# EasyEDA schematic schematics.json

## Sheets
1 Thal: TITLE: Thal; REV: C; Date: 2024-07-05; Sheet: 1/1; Drawn By: Arthur LAURENT; Company: Mental Noise
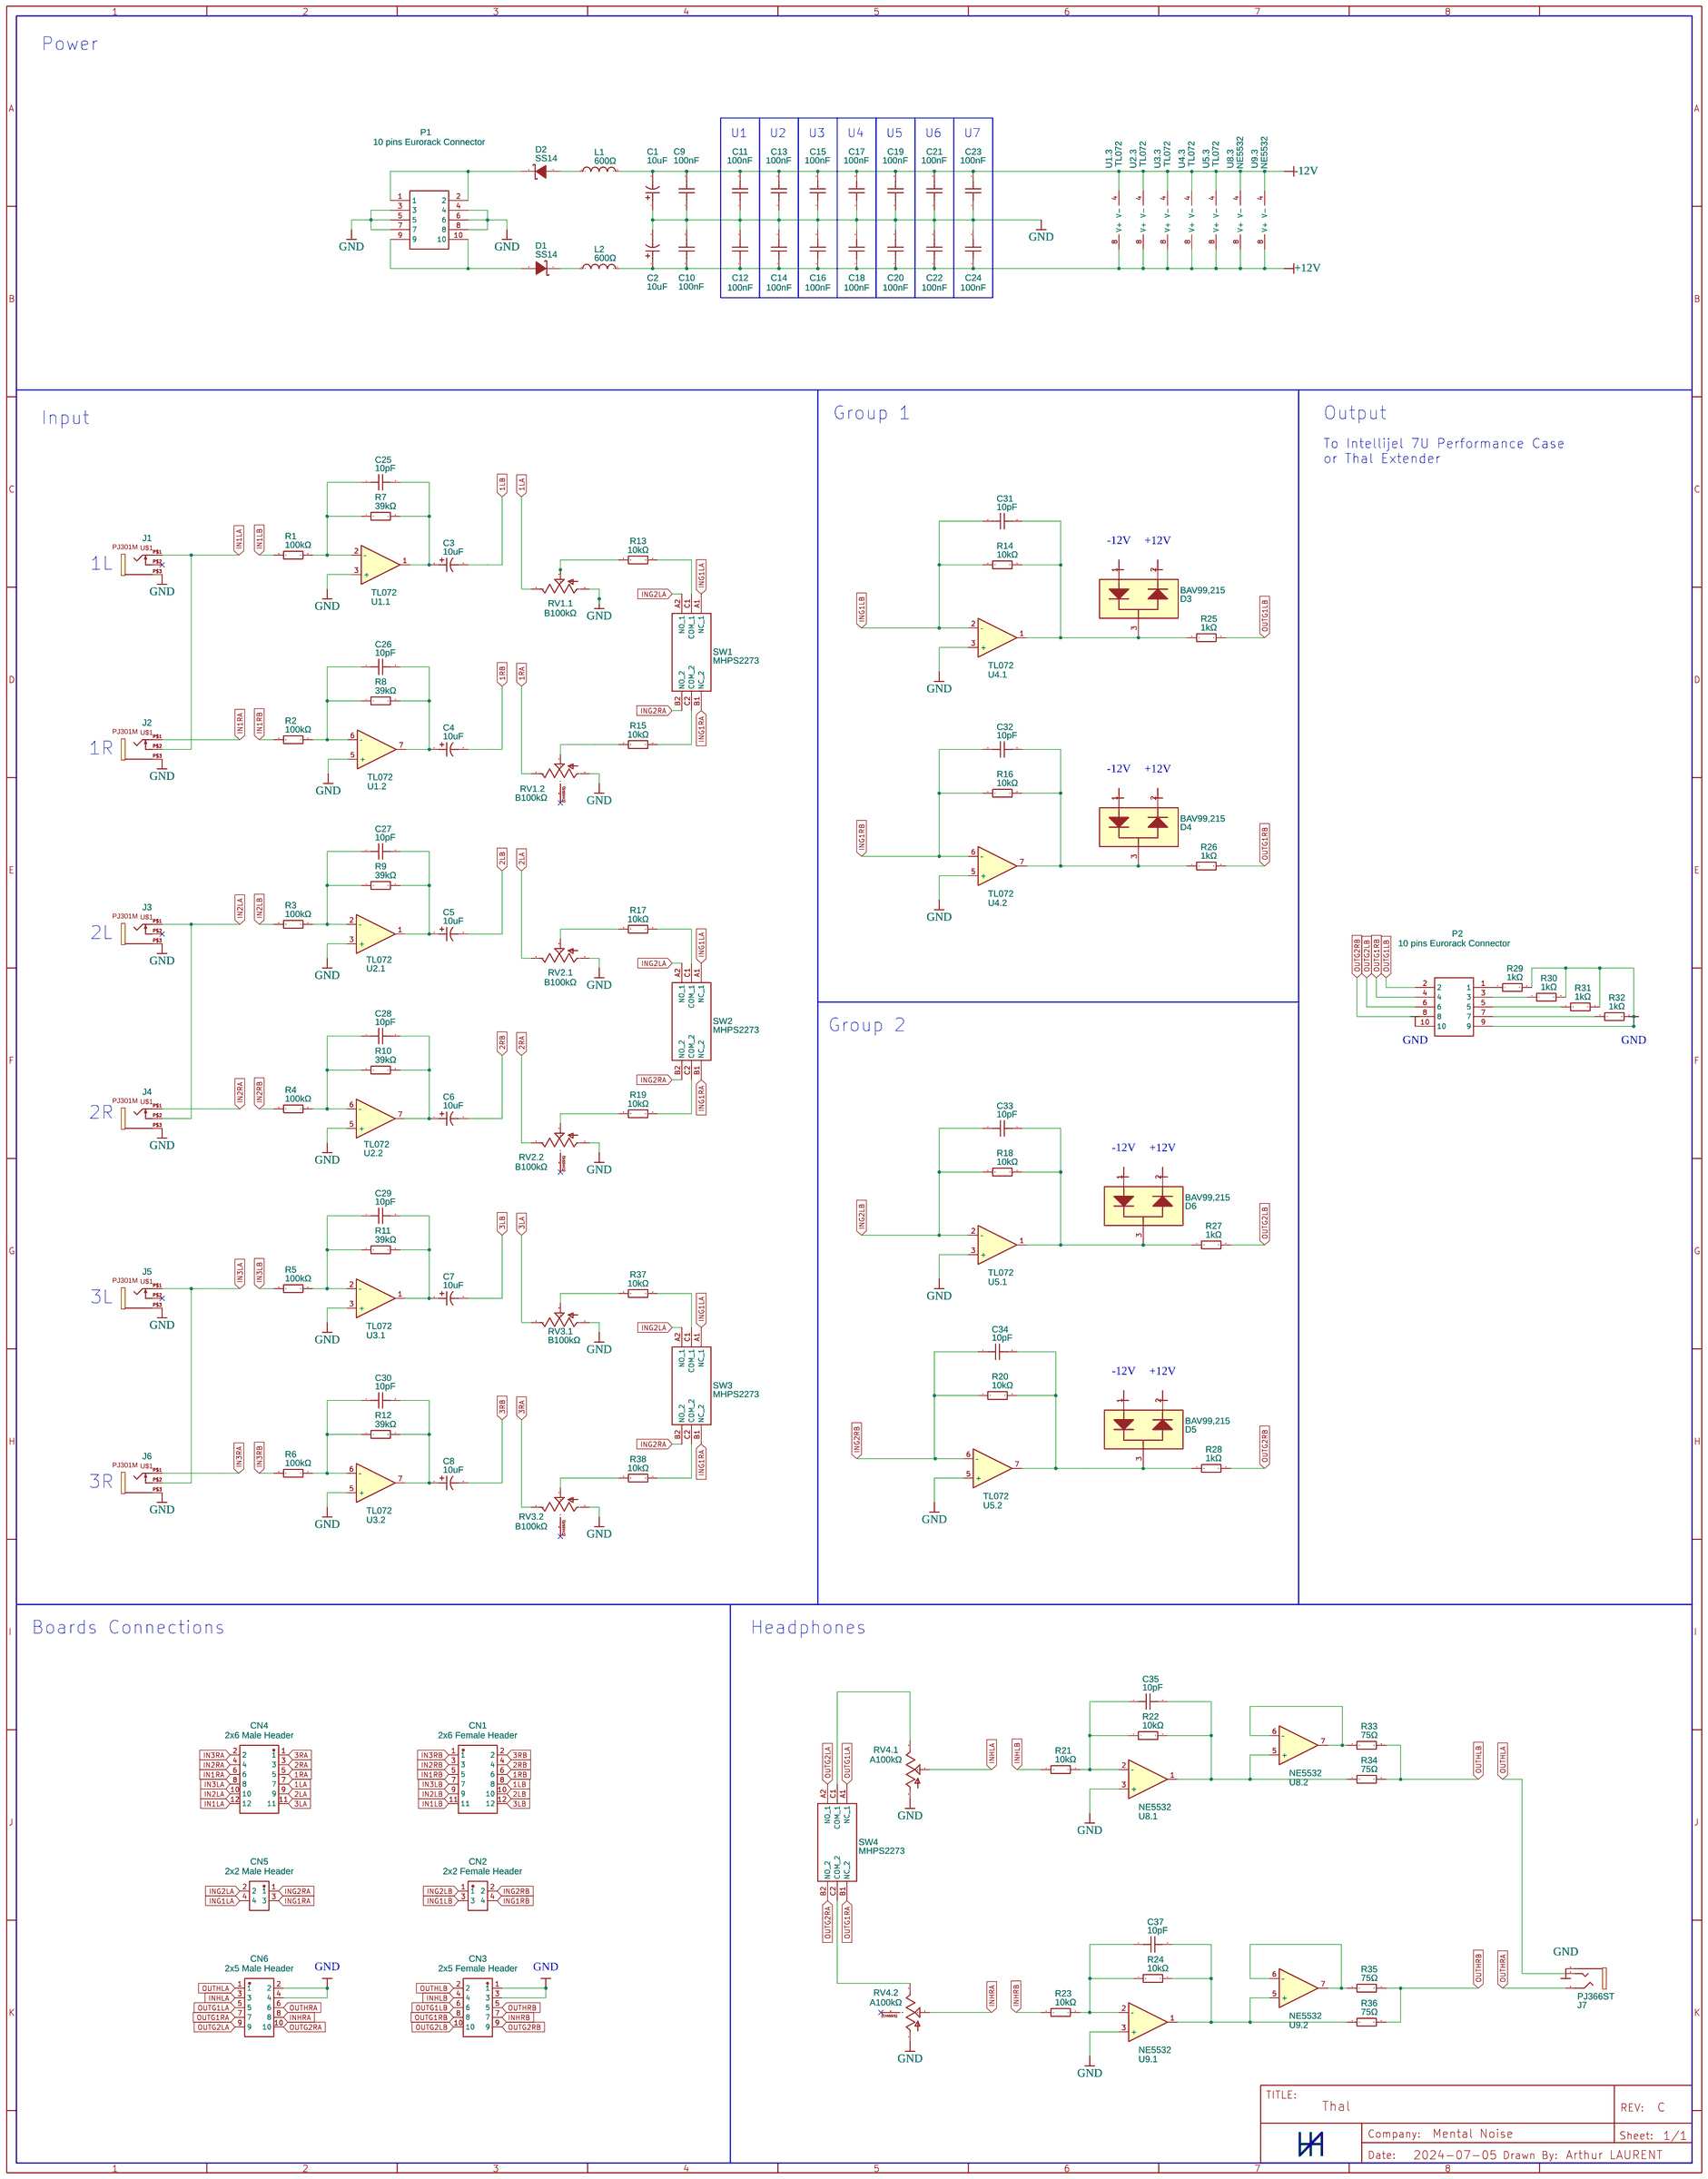
[diagram p0: Thal]
2 Extender: TITLE: Thal Extender; REV: A
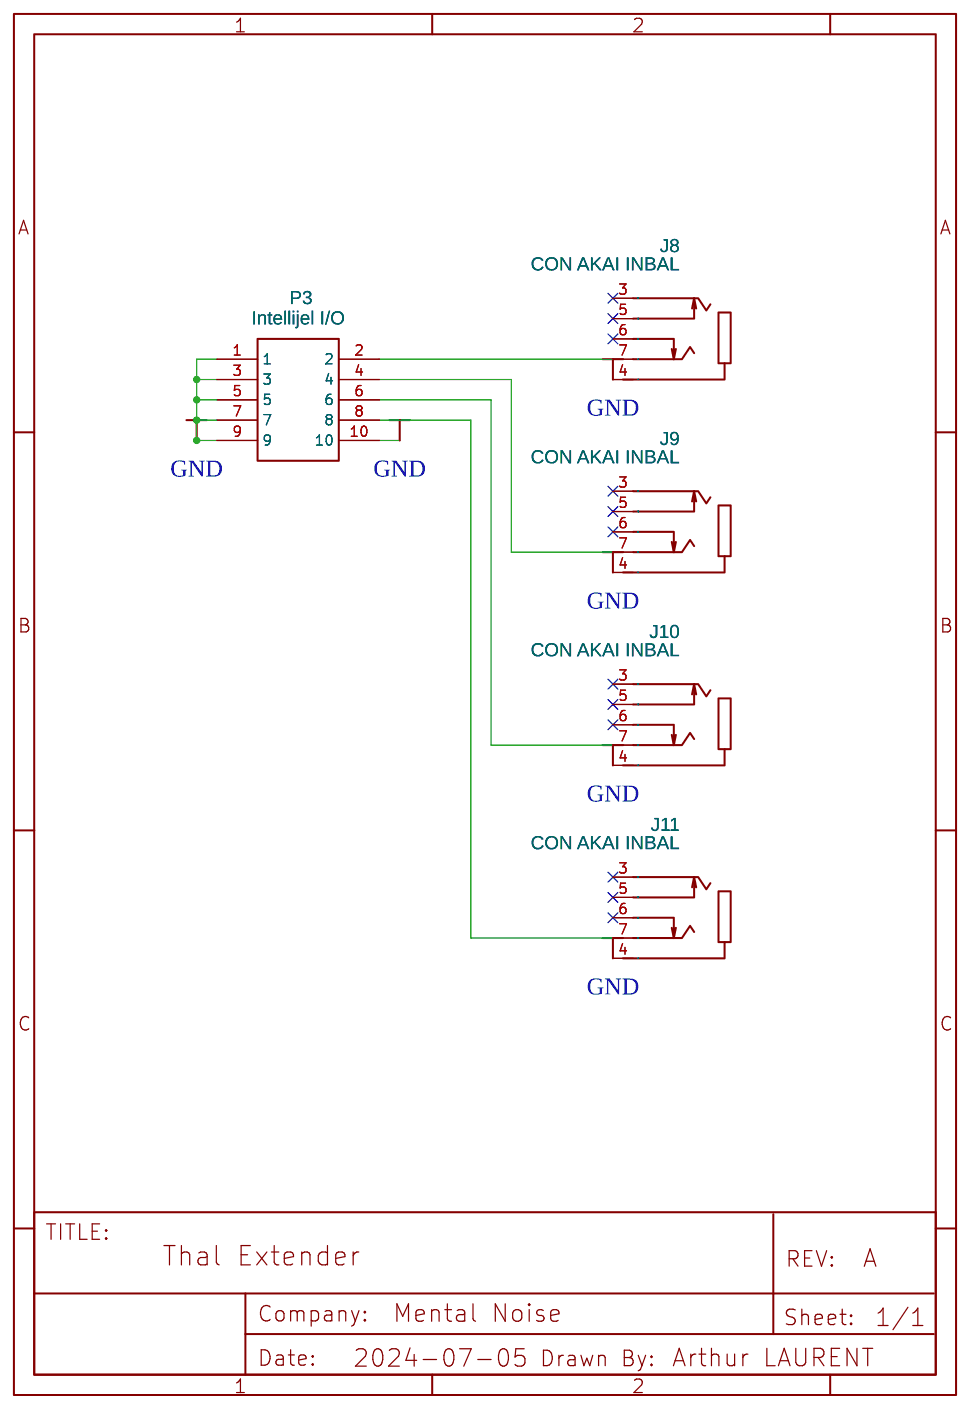
[diagram p1: Extender]

## Parts
sheet Extender
J8  CON AKAI INBAL  [PJ-612]
J9  CON AKAI INBAL  [PJ-612]
J10  CON AKAI INBAL  [PJ-612]
J11  CON AKAI INBAL  [PJ-612]
P3  Intellijel I/O  [IDC-TH_10P-P2.54-V-R2-C5-S2.54]
sheet Thal
C1  10uF  [CAP-TH_BD6.3-P2.5-D0.5]
C2  10uF  [CAP-TH_BD6.3-P2.5-D0.5]
C3  10uF  [CAP-TH_BD6.3-P2.5-D0.5]
C4  10uF  [CAP-TH_BD6.3-P2.5-D0.5]
C5  10uF  [CAP-TH_BD6.3-P2.5-D0.5]
C6  10uF  [CAP-TH_BD6.3-P2.5-D0.5]
C7  10uF  [CAP-TH_BD6.3-P2.5-D0.5]
C8  10uF  [CAP-TH_BD6.3-P2.5-D0.5]
C9  100nF  [C0402]
C10  100nF  [C0402]
C11  100nF  [C0402]
C12  100nF  [C0402]
C13  100nF  [C0402]
C14  100nF  [C0402]
C15  100nF  [C0402]
C16  100nF  [C0402]
C17  100nF  [C0402]
C18  100nF  [C0402]
C19  100nF  [C0402]
C20  100nF  [C0402]
C21  100nF  [C0402]
C22  100nF  [C0402]
C23  100nF  [C0402]
C24  100nF  [C0402]
C25  10pF  [C0402]
C26  10pF  [C0402]
C27  10pF  [C0402]
C28  10pF  [C0402]
C29  10pF  [C0402]
C30  10pF  [C0402]
C31  10pF  [C0402]
C32  10pF  [C0402]
C33  10pF  [C0402]
C34  10pF  [C0402]
C35  10pF  [C0402]
C37  10pF  [C0402]
CN1  2x6 Female Header  [HDR-TH_12P-P2.54-V-M-R2-C6-S2.54]
CN2  2x2 Female Header  [HDR-TH_4P-P2.54-V-M-R2-C2-S2.54]
CN3  2x5 Female Header  [HDR-TH_10P-P2.54-V-M-R2-C5-S2.54-2]
CN4  2x6 Male Header  [HDR-TH_12P-P2.54-V-M-R2-C6-S2.54]
CN5  2x2 Male Header  [HDR-TH_4P-P2.54-V-M-R2-C2-S2.54]
CN6  2x5 Male Header  [HDR-TH_10P-P2.54-V-M-R2-C5-S2.54-2]
D1  SS14  [SMA_L4.2-W2.6-LS5.3-RD]
D2  SS14  [SMA_L4.2-W2.6-LS5.3-RD]
D3  BAV99,215  [SOT-23-3_L2.9-W1.6-P1.90-LS2.8-BR]
D4  BAV99,215  [SOT-23-3_L2.9-W1.6-P1.90-LS2.8-BR]
D5  BAV99,215  [SOT-23-3_L2.9-W1.6-P1.90-LS2.8-BR]
D6  BAV99,215  [SOT-23-3_L2.9-W1.6-P1.90-LS2.8-BR]
J1  PJ301M  [PJ301M]
J2  PJ301M  [PJ301M]
J3  PJ301M  [PJ301M]
J4  PJ301M  [PJ301M]
J5  PJ301M  [PJ301M]
J6  PJ301M  [PJ301M]
J7  PJ366ST  [PJ301M]
L1  600Ω  [L0805]
L2  600Ω  [L0805]
P1  10 pins Eurorack Connector  [IDC-TH_10P-P2.54-V-R2-C5-S2.54]
P2  10 pins Eurorack Connector  [IDC-TH_10P-P2.54-V-R2-C5-S2.54]
R1  100kΩ  [R0402]
R2  100kΩ  [R0402]
R3  100kΩ  [R0402]
R4  100kΩ  [R0402]
R5  100kΩ  [R0402]
R6  100kΩ  [R0402]
R7  39kΩ  [R0603]
R8  39kΩ  [R0603]
R9  39kΩ  [R0603]
R10  39kΩ  [R0603]
R11  39kΩ  [R0603]
R12  39kΩ  [R0603]
R13  10kΩ  [R-AXIAL-0.3]
R14  10kΩ  [R0402]
R15  10kΩ  [R-AXIAL-0.3]
R16  10kΩ  [R0402]
R17  10kΩ  [R-AXIAL-0.3]
R18  10kΩ  [R0402]
R19  10kΩ  [R-AXIAL-0.3]
R20  10kΩ  [R0402]
R21  10kΩ  [R0402]
R22  10kΩ  [R0402]
R23  10kΩ  [R0402]
R24  10kΩ  [R0402]
R25  1kΩ  [R1206]
R26  1kΩ  [R1206]
R27  1kΩ  [R1206]
R28  1kΩ  [R1206]
R29  1kΩ  [R1206]
R30  1kΩ  [R1206]
R31  1kΩ  [R1206]
R32  1kΩ  [R1206]
R33  75Ω  [R0603]
R34  75Ω  [R0603]
R35  75Ω  [R0603]
R36  75Ω  [R0603]
R37  10kΩ  [R-AXIAL-0.3]
R38  10kΩ  [R-AXIAL-0.3]
RV1  B100kΩ  [DUAL_9MM_SNAP-IN_POT]  (sections 1,2)
RV2  B100kΩ  [DUAL_9MM_SNAP-IN_POT]  (sections 1,2)
RV3  B100kΩ  [DUAL_9MM_SNAP-IN_POT]  (sections 1,2)
RV4  A100kΩ  [DUAL_9MM_SNAP-IN_POT]  (sections 1,2)
SW1  MHPS2273  [MHPS2273]
SW2  MHPS2273  [MHPS2273]
SW3  MHPS2273  [MHPS2273]
SW4  MHPS2273  [MHPS2273]
U1  TL072  [TL072]  (sections 1,2,3)
U2  TL072  [TL072]  (sections 1,2,3)
U3  TL072  [TL072]  (sections 1,2,3)
U4  TL072  [TL072]  (sections 1,2,3)
U5  TL072  [TL072]  (sections 1,2,3)
U8  NE5532  [TL072]  (sections 1,2,3)
U9  NE5532  [TL072]  (sections 1,2,3)

## Library data of the parts
J8-J11 = CON AKAI INBAL: Supplier: LCSC; Supplier Part: C309284; Manufacturer: HOOYA; Contributor: LCSC
P1-P3 = CONN ISP 10P: Supplier: LCSC; Manufacturer: SAMTEC; Manufacturer Part: TST-105-02-G-D; Contributor: LCSC; Supplier Part: C131327
C1-C8 = CD1101061HM0511VFL: Supplier: LCSC; Supplier Part: C7493876; Manufacturer: HRK(鸿瑞凯电子); Contributor: lcsc; JLCPCB Part Class: Extended Part
C9-C24 = CL05B104KB54PNC: Contributor: LCSC; Supplier: LCSC; Supplier Part: C307331; Manufacturer: SAMSUNG(三星); JLCPCB Part Class: Basic Part
C25-C35 C37 = CL05C100JB5NNNC: Supplier: LCSC; Manufacturer: SAMSUNG(三星); Supplier Part: C32949; JLCPCB Part Class: Basic Part
CN1 CN4 = 0702804404: Contributor: lcsc; Supplier: LCSC; Supplier Part: C3333696; Manufacturer: MOLEX
CN2 CN5 = PZ254-2-02-Z-8.5_C3012242: Contributor: lcsc; Supplier: LCSC; Supplier Part: C3012242; Manufacturer: HCTL(华灿天禄); Manufacturer Part: PZ254-2-02-Z-8.5
CN3 CN6 = 147255-2: Supplier: LCSC; Supplier Part: C6785461; Manufacturer: TE Connectivity(泰科电子); Contributor: lcsc
D1 D2 = SS14: Supplier: LCSC; Manufacturer: MDD; Supplier Part: C2480; JLCPCB Part Class: Basic Part
D3-D6 = BAV99,215: Supplier: LCSC; Manufacturer: Nexperia(安世); Supplier Part: C2500; JLCPCB Part Class: Basic Part
J1-J6 = PJ301M: Manufacturer: thonk; link: https://www.thonk.co.uk/shop/thonkiconn/; Contributor: Christian Bloch
J7 = PJ366ST: Contributor: recursinging
L1 L2 = GZ2012D601TF: Supplier: LCSC; Manufacturer: Sunlord(顺络); Supplier Part: C1017; JLCPCB Part Class: Basic Part
R1-R6 = 0402WGF1003TCE: Supplier: LCSC; Manufacturer: UNI-ROYAL(厚声); Supplier Part: C25741; JLCPCB Part Class: Basic Part
R7-R12 = 0603WAF3902T5E: Supplier: LCSC; Manufacturer: UNI-ROYAL(厚声); Supplier Part: C23153; JLCPCB Part Class: Basic Part
R13 R15 R17 R19 R37 R38 = MFR0W4F2200A50: Supplier: LCSC; Manufacturer: UniOhm; Supplier Part: C57439
R14 R16 R18 R20-R24 = 0402WGF1002TCE: Supplier: LCSC; Manufacturer: UNI-ROYAL(厚声); Supplier Part: C25744; JLCPCB Part Class: Basic Part
R25-R32 = 1206W4F1001T5E: Supplier: LCSC; Manufacturer: UNI-ROYAL(厚声); Supplier Part: C4410; JLCPCB Part Class: Basic Part
R33-R36 = 0603WAF750JT5E: Supplier: LCSC; Manufacturer: UNI-ROYAL(厚声); Supplier Part: C4275; JLCPCB Part Class: Basic Part
RV1-RV4 = RD902F-ALPHA-9MM-DUAL-POT COPY: Contributor: rossgrady; subpart_no: 1
SW1-SW4 = MHPS2273
U1-U5 = TL072: Contributor: single_coil_hum; subpart_no: 1; Supplier Part: C6961; Supplier: LCSC
U8 U9 = TL072: Contributor: single_coil_hum; subpart_no: 1; Supplier Part: C7426; Supplier: LCSC

## Nets
+12V: C2.1 C10.1 C12.1 C14.1 C16.1 C18.1 C20.1 C22.1 C24.1 D3.2 D4.2 D5.2 D6.2 L2.2 U1.8(V+) U2.8(V+) U3.8(V+) U4.8(V+) U5.8(V+) U8.8(V+) U9.8(V+)
-12V: C1.2 C9.2 C11.2 C13.2 C15.2 C17.2 C19.2 C21.2 C23.2 D3.1 D4.1 D5.1 D6.1 L1.2 U1.4(V-) U2.4(V-) U3.4(V-) U4.4(V-) U5.4(V-) U8.4(V-) U9.4(V-)
GND: C1.1 C2.2 C9.1 C10.2 C11.1 C12.2 C13.1 C14.2 C15.1 C16.2 C17.1 C18.2 C19.1 C20.2 C21.1 C22.2 C23.1 C24.2 CN3.1 CN3.3 CN6.2 CN6.4 J1.P$3(1) J2.P$3(1) J3.P$3(1) J4.P$3(1) J5.P$3(1) J6.P$3(1) J7.P$3(S) J8.4 J9.4 J10.4 J11.4 P1.3 P1.4 P1.5 P1.6 P1.7 P1.8 P2.9 P2.10 P3.1 P3.3 P3.5 P3.7 P3.9 P3.10 R29.2 R30.2 R31.2 R32.2 RV1.1(A) RV1.1B(A) RV2.1(A) RV2.1B(A) RV3.1(A) RV3.1B(A) RV4.1(A) RV4.1B(A) U1.3(+) U1.5(+) U2.3(+) U2.5(+) U3.3(+) U3.5(+) U4.3(+) U4.5(+) U5.3(+) U5.5(+) U8.3(+) U9.3(+)
1LA: CN4.7 RV1.3B(E)
1LB: C3.2 CN1.8
1RA: CN4.5 RV1.3(E)
1RB: C4.2 CN1.6
2LA: CN4.9 RV2.3B(E)
2LB: C5.2 CN1.10
2RA: CN4.3 RV2.3(E)
2RB: C6.2 CN1.4
3LA: CN4.11 RV3.3B(E)
3LB: C7.2 CN1.12
3RA: CN4.1 RV3.3(E)
3RB: C8.2 CN1.2
IN1LA: CN4.12 J1.P$1(2) J2.P$2(3)
IN1LB: CN1.11 R1.2
IN1RA: CN4.6 J2.P$1(2)
IN1RB: CN1.5 R2.2
IN2LA: CN4.10 J3.P$1(2) J4.P$2(3)
IN2LB: CN1.9 R3.2
IN2RA: CN4.4 J4.P$1(2)
IN2RB: CN1.3 R4.2
IN3LA: CN4.8 J5.P$1(2) J6.P$2(3)
IN3LB: CN1.7 R5.2
IN3RA: CN4.2 J6.P$1(2)
IN3RB: CN1.1 R6.2
ING1LA: CN5.4 SW1.A1(NC_1) SW2.A1(NC_1) SW3.A1(NC_1)
ING1LB: C31.1 CN2.3 R14.1 U4.2(–)
ING1RA: CN5.3 SW1.B1(NC_2) SW2.B1(NC_2) SW3.B1(NC_2)
ING1RB: C32.1 CN2.4 R16.1 U4.6(–)
ING2LA: CN5.2 SW1.A2(NO_1) SW2.A2(NO_1) SW3.A2(NO_1)
ING2LB: C33.1 CN2.1 R18.1 U5.2(–)
ING2RA: CN5.1 SW1.B2(NO_2) SW2.B2(NO_2) SW3.B2(NO_2)
ING2RB: C34.1 CN2.2 R20.1 U5.6(–)
INHLA: CN6.3 RV4.2B(S)
INHLB: CN3.4 R21.1
INHRA: CN6.8 RV4.2(S)
INHRB: CN3.7 R23.1
OUTG1LA: CN6.5 SW4.A1(NC_1)
OUTG1LB: CN3.6 P2.2 R25.2
OUTG1RA: CN6.7 SW4.B1(NC_2)
OUTG1RB: CN3.8 P2.4 R26.2
OUTG2LA: CN6.9 SW4.A2(NO_1)
OUTG2LB: CN3.10 P2.6 R27.2
OUTG2RA: CN6.10 SW4.B2(NO_2)
OUTG2RB: CN3.9 P2.8 R28.2
OUTHLA: CN6.1 J7.P$1(R)
OUTHLB: CN3.2 R33.2 R34.2
OUTHRA: CN6.6 J7.P$2(T)
OUTHRB: CN3.5 R35.2 R36.2
Net-(C3-1): C3.1 C25.2 R7.2 U1.1
Net-(C4-1): C4.1 C26.2 R8.2 U1.7
Net-(C5-1): C5.1 C27.2 R9.2 U2.1
Net-(C6-1): C6.1 C28.2 R10.2 U2.7
Net-(C7-1): C7.1 C29.2 R11.2 U3.1
Net-(C8-1): C8.1 C30.2 R12.2 U3.7
Net-(C25-1): C25.1 R1.1 R7.1 U1.2(–)
Net-(C26-1): C26.1 R2.1 R8.1 U1.6(–)
Net-(C27-1): C27.1 R3.1 R9.1 U2.2(–)
Net-(C28-1): C28.1 R4.1 R10.1 U2.6(–)
Net-(C29-1): C29.1 R5.1 R11.1 U3.2(–)
Net-(C30-1): C30.1 R6.1 R12.1 U3.6(–)
Net-(C31-2): C31.2 D3.3 R14.2 R25.1 U4.1
Net-(C32-2): C32.2 D4.3 R16.2 R26.1 U4.7
Net-(C33-2): C33.2 D6.3 R18.2 R27.1 U5.1
Net-(C34-2): C34.2 D5.3 R20.2 R28.1 U5.7
Net-(C35-1): C35.1 R21.2 R22.1 U8.2(–)
Net-(C35-2): C35.2 R22.2 R34.1 U8.1 U8.5(+)
Net-(C37-1): C37.1 R23.2 R24.1 U9.2(–)
Net-(C37-2): C37.2 R24.2 R36.1 U9.1 U9.5(+)
Net-(D1-1): D1.1(K) L2.1
Net-(D1-2): D1.2(A) P1.9 P1.10
Net-(D2-1): D2.1(K) P1.1 P1.2
Net-(D2-2): D2.2(A) L1.1
Net-(J8-7): J8.7 P3.2
Net-(J9-7): J9.7 P3.4
Net-(J10-7): J10.7 P3.6
Net-(J11-7): J11.7 P3.8
Net-(P2-1): P2.1 R29.1
Net-(P2-3): P2.3 R30.1
Net-(P2-5): P2.5 R31.1
Net-(P2-7): P2.7 R32.1
Net-(R13-1): R13.1 SW1.C1(COM_1)
Net-(R13-2): R13.2 RV1.2B(S)
Net-(R15-1): R15.1 SW1.C2(COM_2)
Net-(R15-2): R15.2 RV1.2(S)
Net-(R17-1): R17.1 SW2.C1(COM_1)
Net-(R17-2): R17.2 RV2.2B(S)
Net-(R19-1): R19.1 SW2.C2(COM_2)
Net-(R19-2): R19.2 RV2.2(S)
Net-(R33-1): R33.1 U8.6(–) U8.7
Net-(R35-1): R35.1 U9.6(–) U9.7
Net-(R37-1): R37.1 SW3.C1(COM_1)
Net-(R37-2): R37.2 RV3.2B(S)
Net-(R38-1): R38.1 SW3.C2(COM_2)
Net-(R38-2): R38.2 RV3.2(S)
Net-(RV1.2-CHASSIS1): RV1.CHASSIS1(P$1) RV1.CHASSIS2(P$1)
Net-(RV2.2-CHASSIS1): RV2.CHASSIS1(P$1) RV2.CHASSIS2(P$1)
Net-(RV3.2-CHASSIS1): RV3.CHASSIS1(P$1) RV3.CHASSIS2(P$1)
Net-(RV4.1-3B): RV4.3B(E) SW4.C1(COM_1)
Net-(RV4.2-3): RV4.3(E) SW4.C2(COM_2)
Net-(RV4.2-CHASSIS1): RV4.CHASSIS1(P$1) RV4.CHASSIS2(P$1)

Not connected (* = marked no-connect by the designer): J1 P$2(3)*; J3 P$2(3)*; J5 P$2(3)*; J8 3* 5* 6*; J9 3* 5* 6*; J10 3* 5* 6*; J11 3* 5* 6*

## Notes on the sheets
sheet 1
- Power
- U1
- U2
- U3
- U4
- U5
- U6
- U7
- Input
- Group 1
- Output
- To Intellijel 7U Performance Case
  or Thal Extender
- 1L
- 1R
- 2L
- Group 2
- 2R
- 3L
- 3R
- Boards Connections
- Headphones
